# EAGLE design IO (EAGLE 4.16)

## Sheet 1 of 2
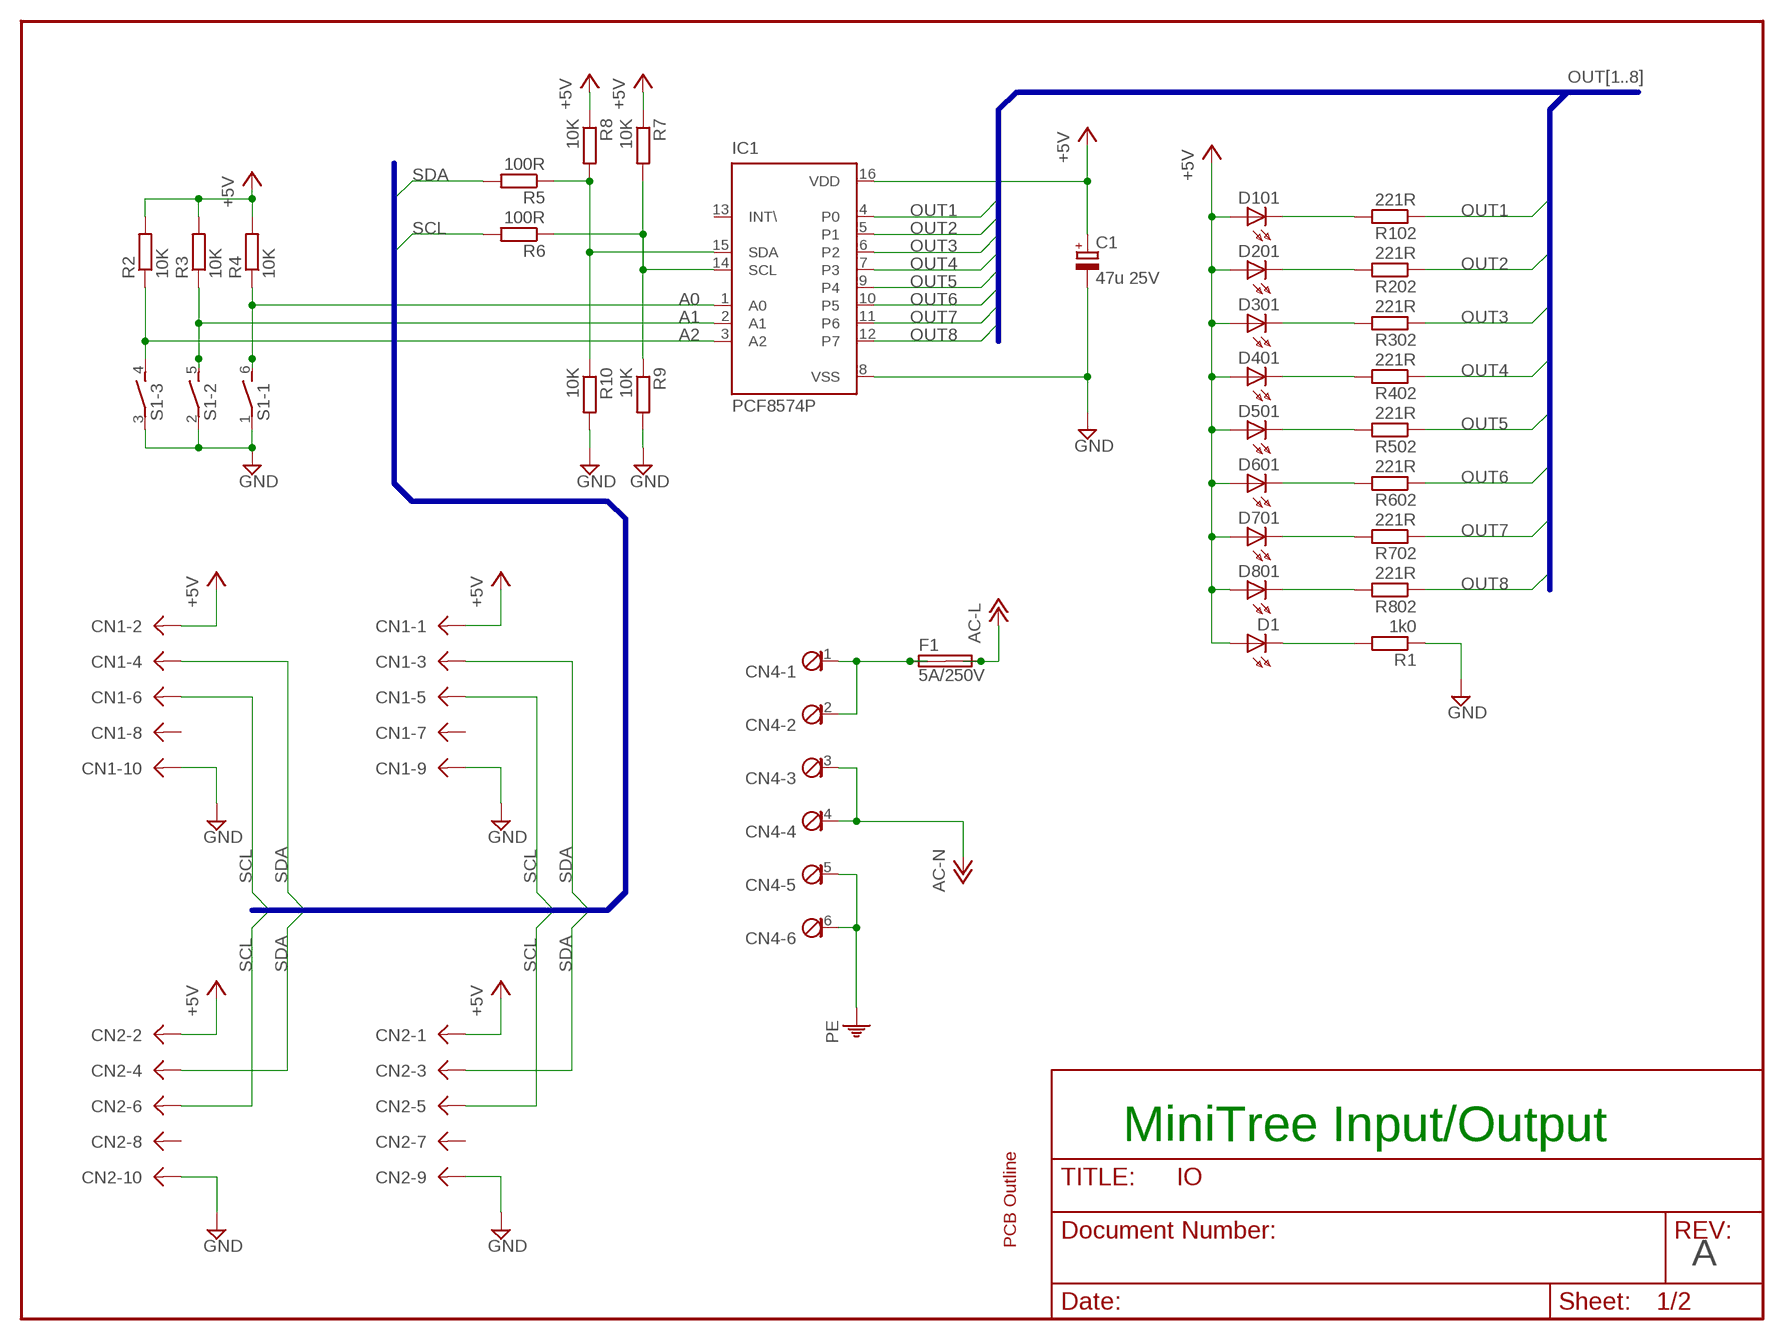
[diagram p0: schematic, sheet 1]

### Parts
C1  47u 25V  CPOL-EUD  [PANASONIC_D]
CN1  HDR2X5  [HDR2X5]
CN2  HDR2X5  [HDR2X5]
CN4  OSTTB06  [OSTTB06]
D1  LEDSMT1206  [1206]
D101  LEDSMT1206  [1206]
D201  LEDSMT1206  [1206]
D301  LEDSMT1206  [1206]
D401  LEDSMT1206  [1206]
D501  LEDSMT1206  [1206]
D601  LEDSMT1206  [1206]
D701  LEDSMT1206  [1206]
D801  LEDSMT1206  [1206]
F1  5A/250V  SHK20L  [SHK20L]
IC1  PCF8574P  [DIL16]
R1  1k0  R-EU_M1206  [M1206]
R2  10K  R-EU_M1206  [M1206]
R3  10K  R-EU_M1206  [M1206]
R4  10K  R-EU_M1206  [M1206]
R5  100R  R-EU_M1206  [M1206]
R6  100R  R-EU_M1206  [M1206]
R7  10K  R-EU_M1206  [M1206]
R8  10K  R-EU_M1206  [M1206]
R9  10K  R-EU_M1206  [M1206]
R10  10K  R-EU_M1206  [M1206]
R102  221R  R-EU_M1206  [M1206]
R202  221R  R-EU_M1206  [M1206]
R302  221R  R-EU_M1206  [M1206]
R402  221R  R-EU_M1206  [M1206]
R502  221R  R-EU_M1206  [M1206]
R602  221R  R-EU_M1206  [M1206]
R702  221R  R-EU_M1206  [M1206]
R802  221R  R-EU_M1206  [M1206]
S1  DS03E  [DS-03]
U$2  3.5X6_8TRIACS  [3.5X6_8TRIACS]

### Nets
+5V: C1.+ CN1.1 CN1.2 CN2.1 CN2.2 D1.A D101.A D201.A D301.A D401.A D501.A D601.A D701.A D801.A IC1.16(VDD) R2.2 R3.2 R4.2 R7.1 R8.1 ; also sheet 2
A0: IC1.1(A0) R4.1 S1.6
A1: IC1.2(A1) R3.1 S1.5
A2: IC1.3(A2) R2.1 S1.4
AC-L: F1.2A F1.2B ; also sheet 2
AC-N: CN4.3 CN4.4 ; also sheet 2
GND: C1.- CN1.9 CN1.10 CN2.9 CN2.10 IC1.8(VSS) R1.1 R9.2 R10.2 S1.1 S1.2 S1.3
N$33: D101.C R102.2
N$35: CN4.1 CN4.2 F1.1A F1.1B
N$36: D201.C R202.2
N$37: D301.C R302.2
N$38: D401.C R402.2
N$39: D501.C R502.2
N$40: D601.C R602.2
N$41: D701.C R702.2
N$42: D801.C R802.2
N$43: D1.C R1.2
N$46: IC1.14(SCL) R6.1 R7.2 R9.1
N$47: IC1.15(SDA) R5.1 R8.2 R10.1
OUT1: IC1.4(P0) R102.1 ; also sheet 2
OUT2: IC1.5(P1) R202.1 ; also sheet 2
OUT3: IC1.6(P2) R302.1 ; also sheet 2
OUT4: IC1.7(P3) R402.1 ; also sheet 2
OUT5: IC1.9(P4) R502.1 ; also sheet 2
OUT6: IC1.10(P5) R602.1 ; also sheet 2
OUT7: IC1.11(P6) R702.1 ; also sheet 2
OUT8: IC1.12(P7) R802.1 ; also sheet 2
PE: CN4.5 CN4.6 ; also sheet 2
SCL: CN1.5 CN1.6 CN2.5 CN2.6 R6.2
SDA: CN1.3 CN1.4 CN2.3 CN2.4 R5.2
Unconnected: CN1.7 CN1.8 CN2.7 CN2.8 IC1.13(INT\)

### Buses
OUT[1..8]
SCL,SDA

### Notes on the sheet
- MiniTree Input/Output
- A

## Sheet 2 of 2
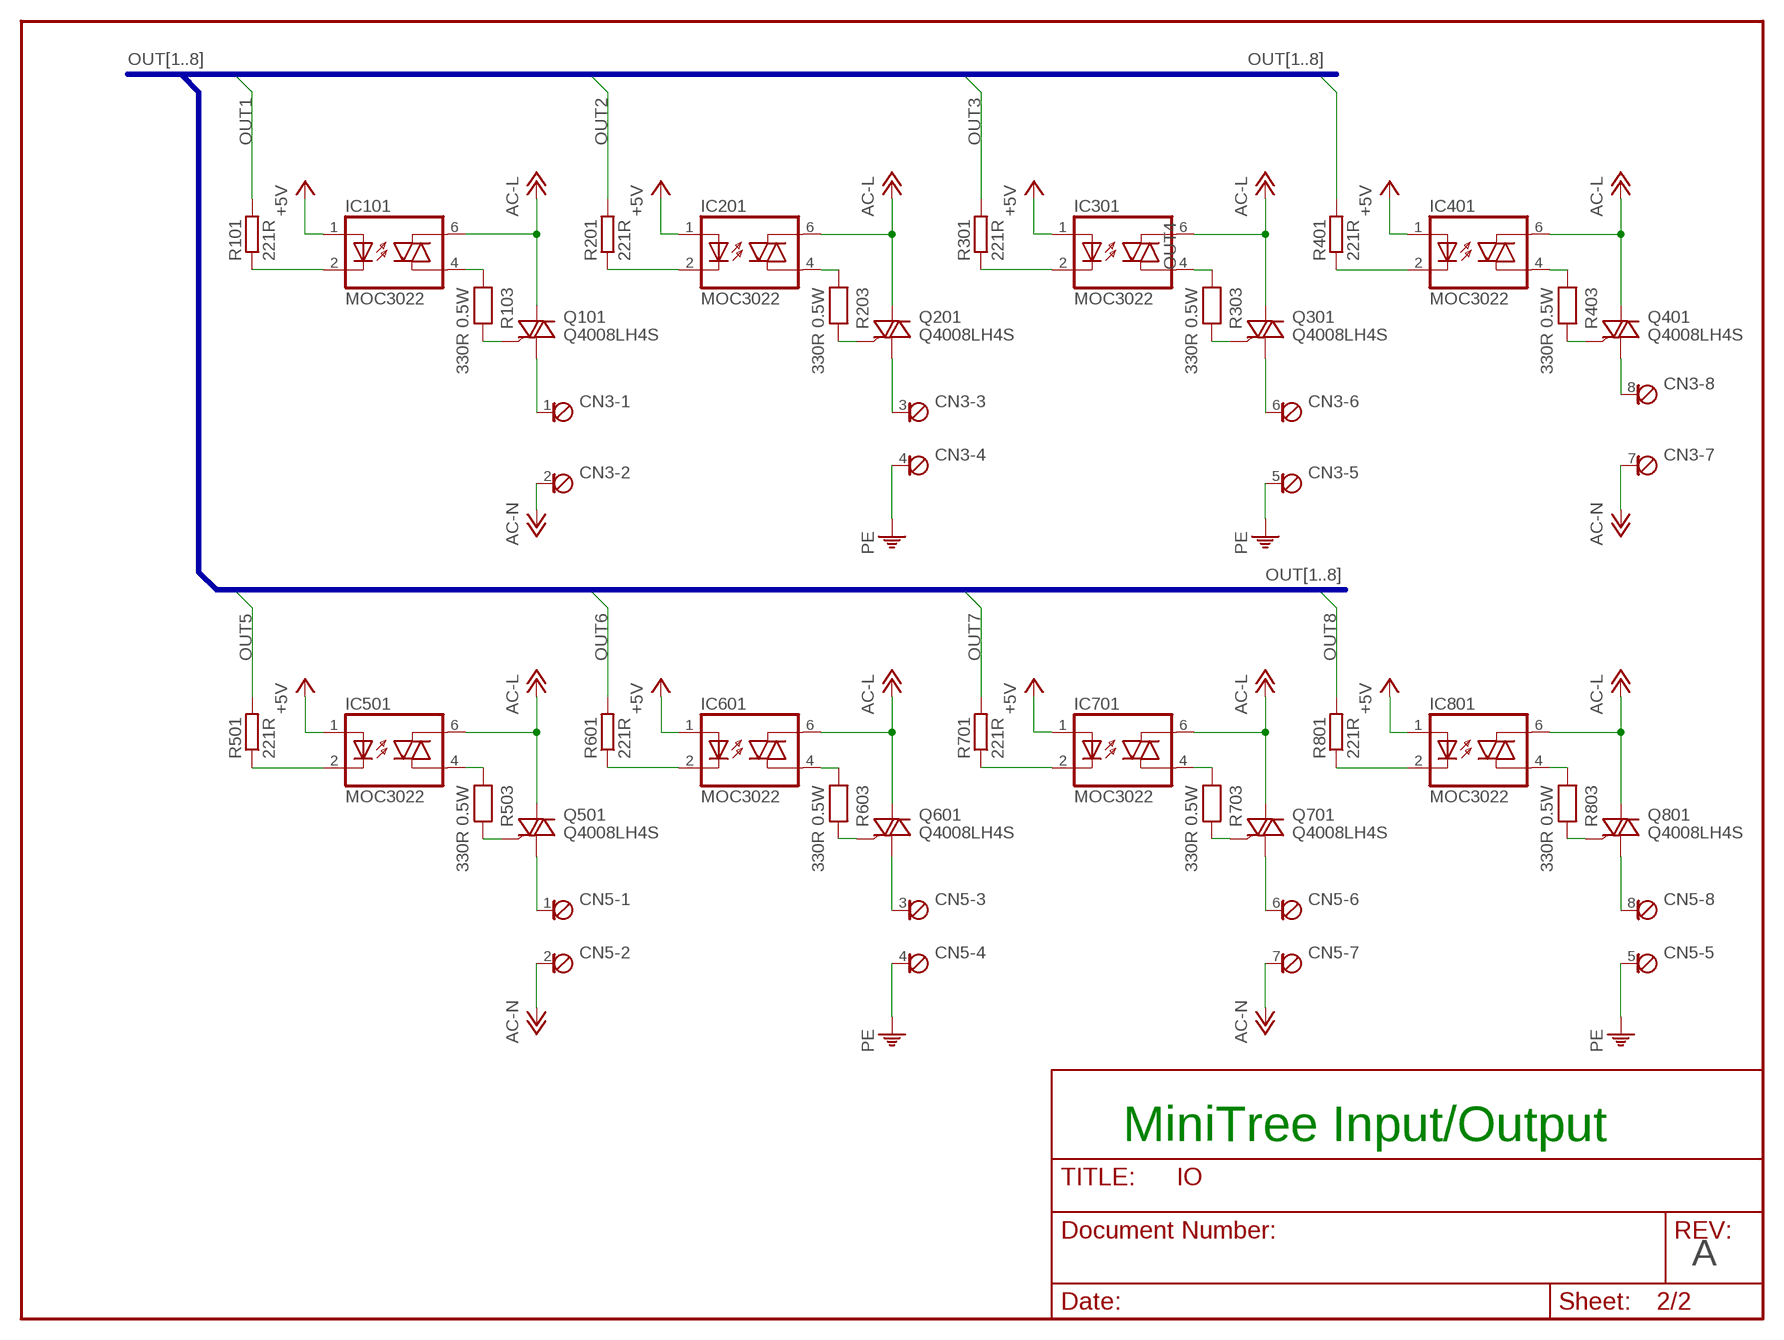
[diagram p1: schematic, sheet 2]

### Parts
CN3  OSTTB08  [OSTTB08]
CN5  OSTTB08  [OSTTB08]
IC101  MOC3022  [DIL06]
IC201  MOC3022  [DIL06]
IC301  MOC3022  [DIL06]
IC401  MOC3022  [DIL06]
IC501  MOC3022  [DIL06]
IC601  MOC3022  [DIL06]
IC701  MOC3022  [DIL06]
IC801  MOC3022  [DIL06]
Q101  Q4008LH4S  [TO220TRI2]
Q201  Q4008LH4S  [TO220TRI2]
Q301  Q4008LH4S  [TO220TRI2]
Q401  Q4008LH4S  [TO220TRI2]
Q501  Q4008LH4S  [TO220TRI2]
Q601  Q4008LH4S  [TO220TRI2]
Q701  Q4008LH4S  [TO220TRI2]
Q801  Q4008LH4S  [TO220TRI2]
R101  221R  R-EU_M1206  [M1206]
R103  330R 0.5W  RESEU-10  [R-10]
R201  221R  R-EU_M1206  [M1206]
R203  330R 0.5W  RESEU-10  [R-10]
R301  221R  R-EU_M1206  [M1206]
R303  330R 0.5W  RESEU-10  [R-10]
R401  221R  R-EU_M1206  [M1206]
R403  330R 0.5W  RESEU-10  [R-10]
R501  221R  R-EU_M1206  [M1206]
R503  330R 0.5W  RESEU-10  [R-10]
R601  221R  R-EU_M1206  [M1206]
R603  330R 0.5W  RESEU-10  [R-10]
R701  221R  R-EU_M1206  [M1206]
R703  330R 0.5W  RESEU-10  [R-10]
R801  221R  R-EU_M1206  [M1206]
R803  330R 0.5W  RESEU-10  [R-10]

### Nets
+5V: IC101.1(A) IC201.1(A) IC301.1(A) IC401.1(A) IC501.1(A) IC601.1(A) IC701.1(A) IC801.1(A) ; also sheet 1
AC-L: IC101.6(A2) IC201.6(A2) IC301.6(A2) IC401.6(A2) IC501.6(A2) IC601.6(A2) IC701.6(A2) IC801.6(A2) Q101.A2(MT2) Q201.A2(MT2) Q301.A2(MT2) Q401.A2(MT2) Q501.A2(MT2) Q601.A2(MT2) Q701.A2(MT2) Q801.A2(MT2) ; also sheet 1
AC-N: CN3.2 CN3.7 CN5.2 CN5.7 ; also sheet 1
N$1: IC101.2(C) R101.1
N$2: IC801.2(C) R801.1
N$3: CN3.1 Q101.A1(MT1)
N$4: IC201.2(C) R201.1
N$5: IC701.2(C) R701.1
N$6: IC601.2(C) R601.1
N$7: IC501.2(C) R501.1
N$8: CN3.3 Q201.A1(MT1)
N$9: IC301.2(C) R301.1
N$10: IC401.2(C) R401.1
N$11: CN3.6 Q301.A1(MT1)
N$12: CN3.8 Q401.A1(MT1)
N$13: CN5.1 Q501.A1(MT1)
N$14: CN5.3 Q601.A1(MT1)
N$15: CN5.6 Q701.A1(MT1)
N$16: CN5.8 Q801.A1(MT1)
N$18: IC101.4(A1) R103.1
N$19: Q101.G R103.2
N$20: IC401.4(A1) R403.1
N$21: Q401.G R403.2
N$22: Q301.G R303.2
N$23: IC301.4(A1) R303.1
N$24: IC201.4(A1) R203.1
N$25: Q201.G R203.2
N$26: Q801.G R803.2
N$27: Q701.G R703.2
N$28: Q601.G R603.2
N$29: IC801.4(A1) R803.1
N$30: IC701.4(A1) R703.1
N$31: IC601.4(A1) R603.1
N$32: IC501.4(A1) R503.1
N$34: Q501.G R503.2
OUT1: R101.2 ; also sheet 1
OUT2: R201.2 ; also sheet 1
OUT3: R301.2 ; also sheet 1
OUT4: R401.2 ; also sheet 1
OUT5: R501.2 ; also sheet 1
OUT6: R601.2 ; also sheet 1
OUT7: R701.2 ; also sheet 1
OUT8: R801.2 ; also sheet 1
PE: CN3.4 CN3.5 CN5.4 CN5.5 ; also sheet 1

### Buses
OUT[1..8]

### Notes on the sheet
- MiniTree Input/Output
- A

## Library data of the parts
C1 = rcl:CPOL-EU: POLARIZED CAPACITOR, European symbol
CN1 CN2 = con-amp-modu-header:HDR2X5
CN3 CN5 = con-OSTTBXX:OSTTB08
CN4 = con-OSTTBXX:OSTTB06
D1 D101 D201 D301 D401 D501 D601 D701 D801 = led:LED: LED
F1 = fuse:SHK20L: FUSE HOLDER 5 x 20 mm, SH contact, SHH1 Schukat, E1073 Buerklin
IC1 = micro-philips:PCF8574: I2C-Bus I/O DEVICE
IC101 IC201 IC301 IC401 IC501 IC601 IC701 IC801 = optocoupler:MOC3022
Q101 Q201 Q301 Q401 Q501 Q601 Q701 Q801 = triac:Q4008LH4
R1-R10 R101 R102 R201 R202 R301 R302 R401 R402 R501 R502 R601 R602 R701 R702 R801 R802 = rcl:R-EU_: RESISTOR, European symbol
R103 R203 R303 R403 R503 R603 R703 R803 = discrete:RESEU-10
S1 = switch-dil:DS03E: DIL/CODE SWITCH
U$2 = PCB_Outlines:3.5X6_8TRIACS

## Board
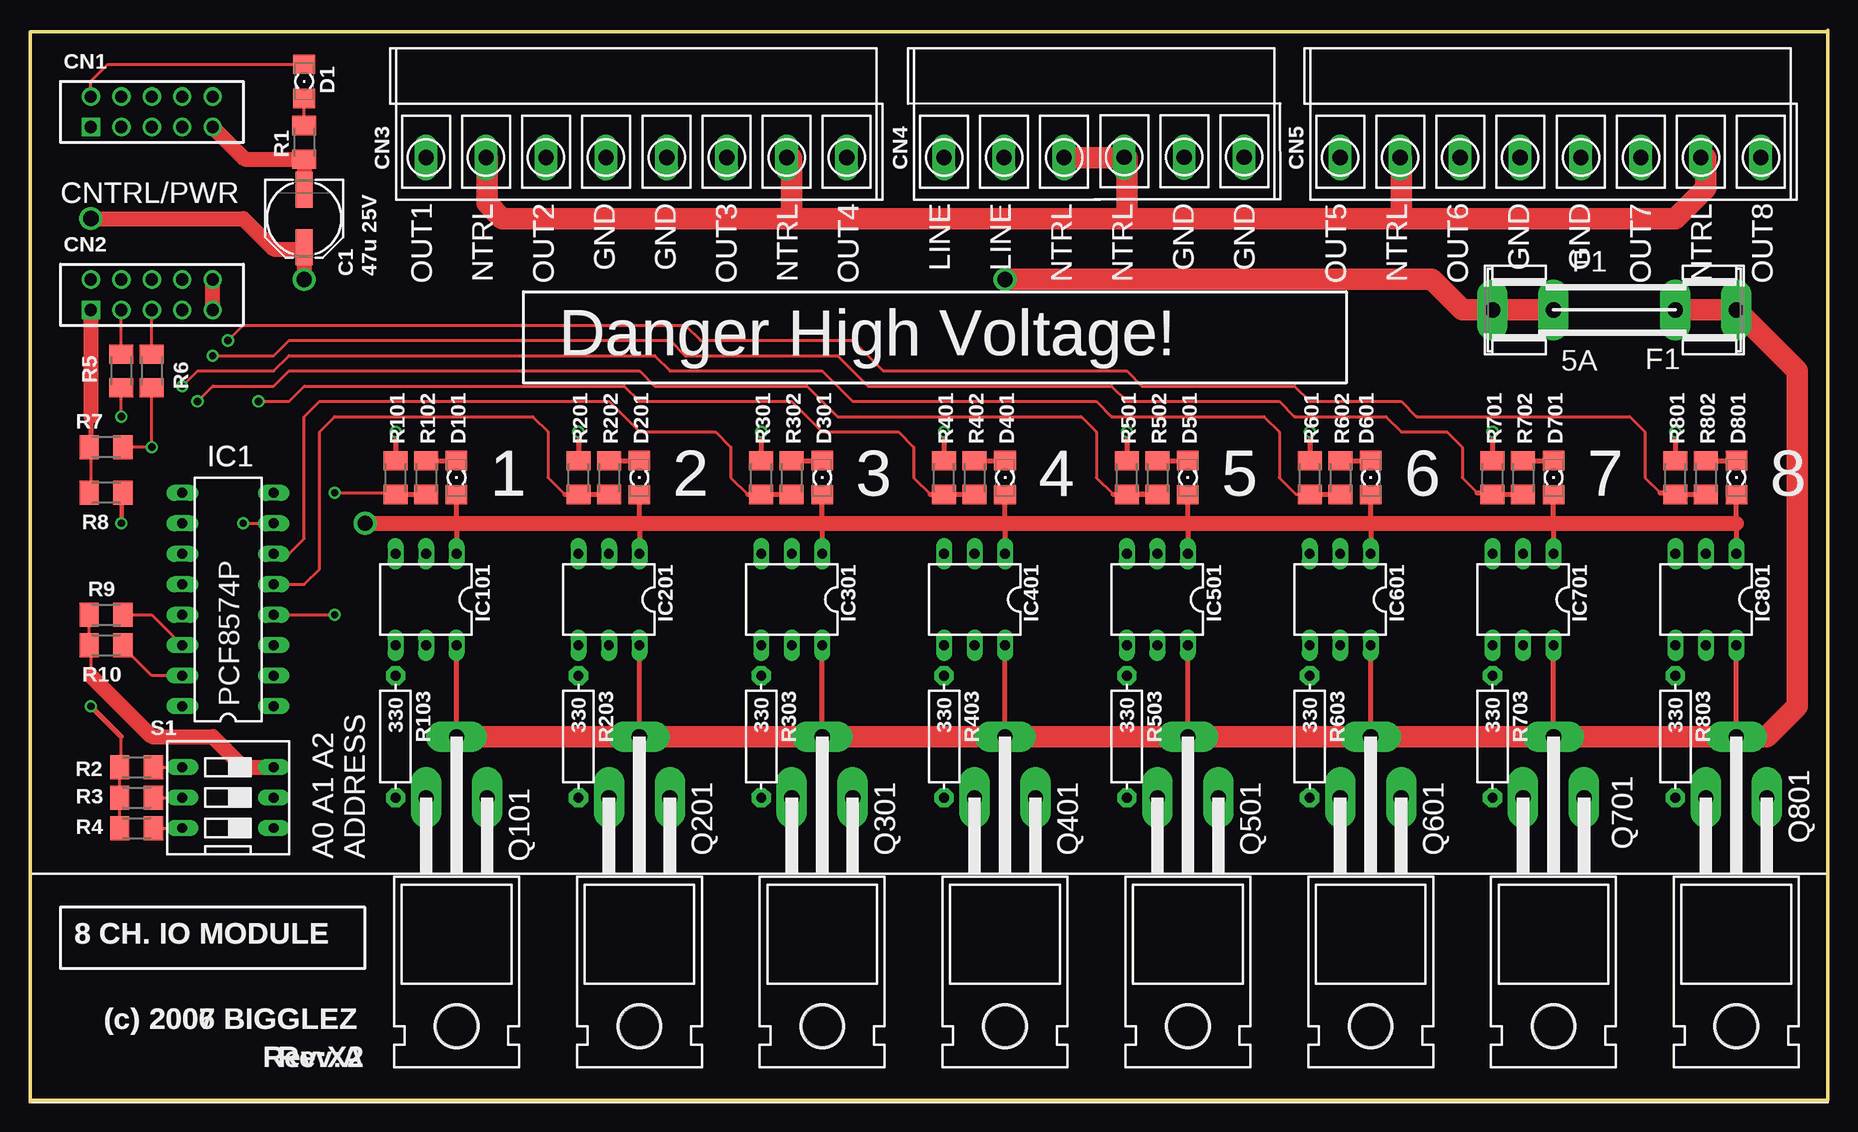
[diagram p2: board, top side]
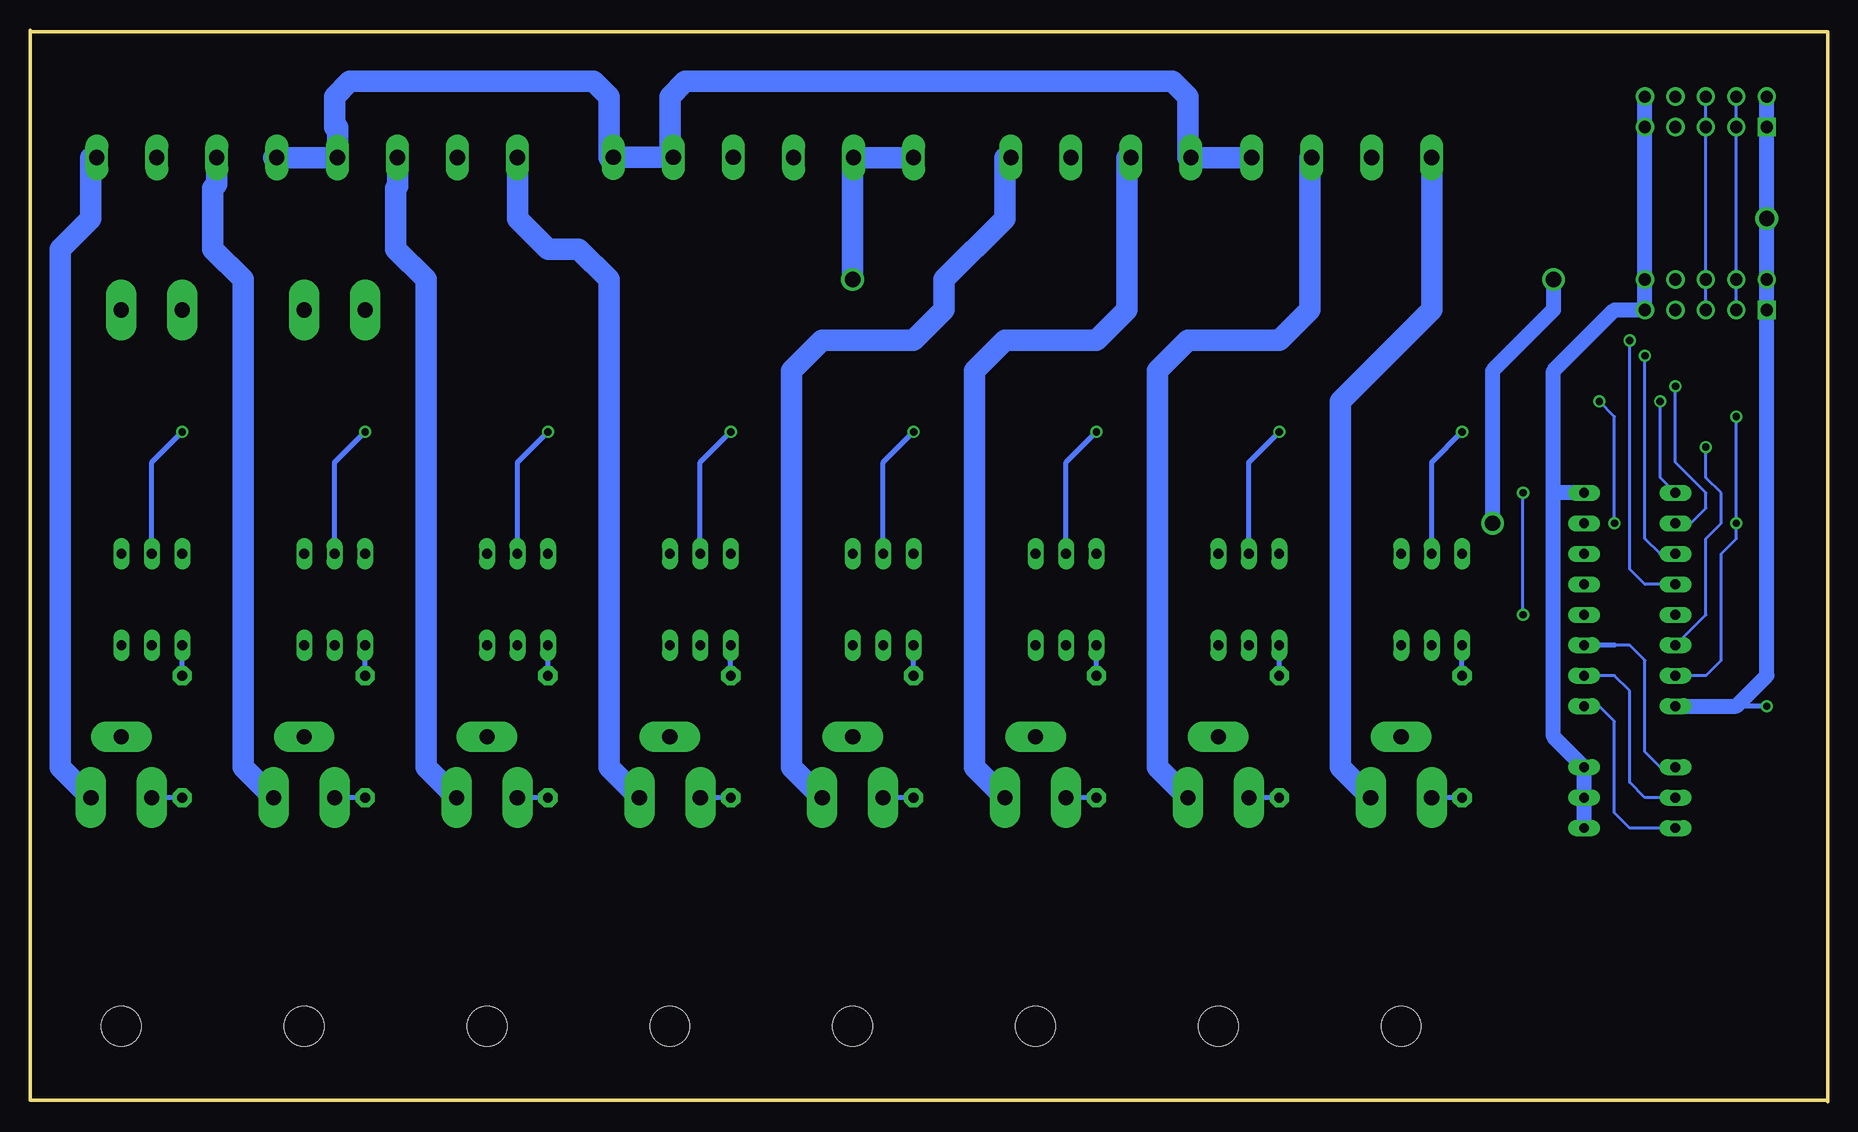
[diagram p3: board, bottom side, seen from below]

Size 149.85 x 89.33 mm. Coordinates in mm from the lower left corner, seen from the top.
Copper layers (1*16): Top 0.035mm / dielectric 1.5mm / Bottom 0.035mm
Design rules "default": minimum track width 10mil, minimum drill 24mil, track to track 8mil, track to pad 8mil, pad to pad 8mil, via to via 8mil, smd to smd 8mil, copper to edge 40mil, drill to drill 8mil, minimum pad ring 10mil, minimum via ring 8mil, stop-mask expansion 4mil, vias tented up to drill 0mil, thermal gap 10mil

### Footprints (pad centres in the part's own frame; a part is rotated, then mirrored left to right if it is on the bottom)
PANASONIC_D = smd 3 x 1.4: + 2.4,0; - -2.4,0
HDR2X5 = drill 1.016 square: 1 0,0 | drill 1.016 round: 2 0,2.54; 3 2.54,0; 4 2.54,2.54; 5 5.08,0; 6 5.08,2.54; 7 7.62,0; 8 7.62,2.54; 9 10.16,0; 10 10.16,2.54
OSTTB08 = drill 1.27 long: 1 0,0; 2 5,0; 3 10,0; 4 15,0; 5 20.066,0; 6 25.066,0; 7 30.066,0; 8 35.066,0
OSTTB06 = drill 1.27 long: 1 0,0; 2 5,0; 3 10,0; 4 15.02,0.03; 5 20.02,0.03; 6 25.02,0.03
1206 = smd 1.6 x 1.803: A -1.422,0; C 1.422,0
SHK20L = drill 1.27 pad 2.54 long: 1A -10.16,0; 1B -5.08,0; 2A 10.16,0; 2B 5.08,0
DIL16 = drill 0.813 long: 1 -8.89,-3.81; 2 -6.35,-3.81; 3 -3.81,-3.81; 4 -1.27,-3.81; 5 1.27,-3.81; 6 3.81,-3.81; 7 6.35,-3.81; 8 8.89,-3.81; 9 8.89,3.81; 10 6.35,3.81; 11 3.81,3.81; 12 1.27,3.81; 13 -1.27,3.81; 14 -3.81,3.81; 15 -6.35,3.81; 16 -8.89,3.81
DIL06 = drill 0.813 long: 1 -2.54,-3.81; 2 0,-3.81; 3 2.54,-3.81; 4 2.54,3.81; 5 0,3.81; 6 -2.54,3.81
TO220TRI2 = drill 1.27 pad 2.54 long: A1 -2.54,-7.62; A2 0,-12.7; G 2.54,-7.62
M1206 = smd 1.6 x 2: 1 -1.4,0; 2 1.4,0
R-10 = drill 0.813 pad 1.6 octagon: 1 -5.08,0; 2 5.08,0
DS-03 = drill 0.813 long: 1 -2.54,-3.81; 2 0,-3.81; 3 2.54,-3.81; 4 2.54,3.81; 5 0,3.81; 6 -2.54,3.81
3.5X6_8TRIACS = hole 3.302: 142.24,6.35; 127,6.35; 111.76,6.35; 96.52,6.35; 81.28,6.35; 66.04,6.35; 50.8,6.35; 35.56,6.35

### Placement (x,y rotation side)
C1  22.86,73.62 270 top
CN1  5.08,81.24 0 top
CN2  5.08,66 0 top
CN3  33.02,78.7 0 top
CN4  76.2,78.7 0 top
CN5  109.22,78.7 0 top
D1  22.86,85.05 270 top
D101  35.55,52.03 90 top
D201  50.79,52.03 90 top
D301  66.04,52.03 90 top
D401  81.28,52.03 90 top
D501  96.52,52.03 90 top
D601  111.76,52.03 90 top
D701  127,52.03 90 top
D801  142.24,52.03 90 top
F1  132.08,66 0 top
IC1  16.51,41.87 90 top
IC101  33.02,41.87 180 top
IC201  48.25,41.87 180 top
IC301  63.49,41.87 180 top
IC401  78.73,41.87 180 top
IC501  93.98,41.87 180 top
IC601  109.22,41.87 180 top
IC701  124.45,41.87 180 top
IC801  139.69,41.87 180 top
Q101  35.55,17.74 180 top
Q201  50.79,17.74 180 top
Q301  66.04,17.74 180 top
Q401  81.28,17.74 180 top
Q501  96.52,17.74 180 top
Q601  111.76,17.74 180 top
Q701  127,17.74 180 top
Q801  142.24,17.74 180 top
R1  22.86,79.97 90 top
R2  8.88,27.9 180 top
R3  8.88,25.36 180 top
R4  8.88,22.82 180 top
R5  7.62,60.92 90 top
R6  10.15,60.92 90 top
R7  6.34,54.57 0 top
R8  6.34,50.76 0 top
R9  6.34,40.6 180 top
R10  6.34,38.06 180 top
R101  30.48,52.03 270 top
R102  33.02,52.03 90 top
R103  30.48,30.44 270 top
R201  45.71,52.03 270 top
R202  48.25,52.03 90 top
R203  45.71,30.44 270 top
R301  60.95,52.03 270 top
R302  63.49,52.03 90 top
R303  60.95,30.44 270 top
R401  76.2,52.03 270 top
R402  78.73,52.03 90 top
R403  76.2,30.44 270 top
R501  91.44,52.03 270 top
R502  93.98,52.03 90 top
R503  91.44,30.44 270 top
R601  106.68,52.03 270 top
R602  109.22,52.03 90 top
R603  106.68,30.44 270 top
R701  121.92,52.03 270 top
R702  124.45,52.03 90 top
R703  121.92,30.44 270 top
R801  137.16,52.03 270 top
R802  139.69,52.03 90 top
R803  137.16,30.44 270 top
S1  16.51,25.36 90 top
U$2  -0.01,-0.04 0 top

### Tracks (layer width: path | path; a pad name or v marks a point on that pad's centre or on a via)
+5V  (via drill 0.61, 1.27)
  Top 0.254: D1.A 6.5,86.47 5.08,85.05 CN1.2 | R4.2 7.49,25.23 7.62,25.36 R3.2 7.49,27.77 7.62,27.9 | 7.62,27.9 R2.2 | 7.62,27.9 7.62,30.44 | R8.1 5.08,50.76 5.08,54.57 R7.1
  Top 0.406: IC701.1 127,48.22 D701.A 127,50.76 | IC601.1 111.76,48.22 D601.A 111.76,50.76 | IC501.1 96.52,48.22 D501.A 96.52,50.76 | IC401.1 81.28,48.22 D401.A 81.28,50.76 | IC301.1 66.04,48.22 D301.A 66.04,50.76 | IC201.1 50.79,48.22 D201.A 50.79,50.76 | D801.A 142.24,48.22 IC801.1 | 35.55,50.76 D101.A 35.55,48.22 IC101.1 | 5.08,57.11 5.08,54.57 | 7.62,30.44 v5.08,32.98
  Top 1.27: 142.24,48.22 127,48.22 111.76,48.22 96.52,48.22 81.28,48.22 66.04,48.22 50.79,48.22 35.55,48.22 v27.94,48.22 | 22.86,71.08 v22.86,68.54 | CN2.1 5.08,57.11 | v5.08,73.62 17.78,73.62 20.32,71.08 22.86,71.08 | 22.86,71.08 C1.+
  Bottom 0.406: v5.08,32.98 IC1.16
  Bottom 1.27: CN2.2 v5.08,73.62 | v5.08,73.62 CN1.1 | CN2.2 CN2.1 5.08,35.52 7.62,32.98 IC1.16 | v27.94,48.22 27.94,60.92 22.86,66 v22.86,68.54 | CN2.2 v5.08,73.62 | CN1.1 CN1.2 CN1.1
A0
  Top 0.254: R4.1 S1.6
  Bottom 0.254: IC1.1 19.05,32.98 17.78,31.71 17.78,24.09 16.51,22.82 S1.6
A1
  Top 0.254: R3.1 S1.5
  Bottom 0.254: IC1.2 17.78,35.52 16.51,34.25 16.51,26.63 15.23,25.36 S1.5
A2
  Top 0.254: R2.1 S1.4
  Bottom 0.254: 17.78,38.06 16.51,38.06 15.23,36.79 15.23,29.17 13.96,27.9 S1.4
  Bottom 0.406: 17.78,38.06 IC1.3
AC-L
  Top 0.406: Q601.A2 111.76,30.19 | Q601.A2 IC601.6 Q601.A2 | Q701.A2 IC701.6 | Q401.A2 IC401.6 | Q301.A2 IC301.6 | Q201.A2 IC201.6 | Q301.A2 IC301.6 | Q301.A2 IC301.6 | Q801.A2 IC801.6 Q801.A2 | Q501.A2 IC501.6 Q501.A2 | Q101.A2 IC101.6 Q101.A2
  Top 1.778: Q101.A2 Q201.A2 Q301.A2 Q401.A2 Q501.A2 Q601.A2 Q701.A2 Q801.A2 144.78,30.44 147.31,32.98 147.31,60.92 F1.2A F1.2B
AC-N
  Top 0.406: 114.3,78.7 CN5.2
  Top 1.778: 114.3,73.62 137.16,73.62 139.69,76.16 139.69,78.7 CN5.7 | 114.3,73.62 114.3,78.7 | 91.44,78.7 91.41,78.73 CN4.4 | 91.44,78.7 CN4.3 | 91.44,73.62 91.44,78.7 | 91.44,73.62 114.3,73.62 | CN3.7 63.49,78.7 63.49,73.62 | 63.49,73.62 91.44,73.62 | 63.49,73.62 39.36,73.62 38.09,74.89 38.09,78.7 CN3.2
GND
  Top 0.254: R10.2 4.95,37.93 5.08,38.06 | R10.2 5.08,38.06 | 5.08,38.06 5.08,35.52 | R9.2 5.08,40.6 4.95,40.47 R10.2
  Top 1.27: R1.1 17.91,78.57 CN1.9 | CN2.9 CN2.10 | 5.08,35.52 10.15,30.44 15.23,30.44 17.78,27.9 S1.3 | R1.1 22.86,78.7 | R1.1 C1.-
  Bottom 1.27: CN1.10 CN1.9 CN2.10 CN2.9 17.78,66 22.86,60.92 22.86,50.76 | S1.1 S1.2 S1.3 22.86,30.44 22.86,50.76 | IC1.8 22.86,50.76
N$1  (via drill 0.61)
  Top 0.406: 30.48,53.3 R101.1 v30.48,55.84
  Bottom 0.406: IC101.2 33.02,53.3 v30.48,55.84
N$2  (via drill 0.61)
  Top 0.406: 137.16,53.3 R801.1 v137.16,55.84
  Bottom 0.406: IC801.2 139.69,53.3 v137.16,55.84
N$3
  Bottom 1.778: Q101.A1 40.63,27.9 40.63,58.38 33.02,66 CN3.1
N$4  (via drill 0.61)
  Top 0.406: 45.71,53.3 R201.1 v45.71,55.84
  Bottom 0.406: IC201.2 48.25,53.3 v45.71,55.84
N$5  (via drill 0.61)
  Top 0.406: 121.92,53.3 R701.1 v121.92,55.84
  Bottom 0.406: IC701.2 124.45,53.3 v121.92,55.84
N$6  (via drill 0.61)
  Top 0.406: 106.68,53.3 R601.1 v106.68,55.84
  Bottom 0.406: IC601.2 109.22,53.3 v106.68,55.84
N$7  (via drill 0.61)
  Top 0.406: 91.44,53.3 R501.1 v91.44,55.84
  Bottom 0.406: IC501.2 93.98,53.3 v91.44,55.84
N$8
  Bottom 1.778: Q201.A1 55.88,27.9 55.88,60.92 53.34,63.46 45.71,63.46 43.17,66 43.17,78.7 CN3.3
N$9  (via drill 0.61)
  Top 0.406: v60.95,55.84 R301.1
  Bottom 0.406: IC301.2 63.49,53.3 v60.95,55.84
N$10  (via drill 0.61)
  Top 0.406: v76.2,55.84 R401.1
  Bottom 0.406: IC401.2 78.73,53.3 v76.2,55.84
N$11
  Bottom 1.778: Q301.A1 71.12,27.9 71.12,60.92 68.58,63.46 60.95,63.46 58.41,66 58.41,78.7 CN3.6
N$12
  Bottom 1.778: Q401.A1 86.36,27.9 86.36,60.92 83.81,63.46 76.2,63.46 73.66,66 73.66,68.54 68.58,73.62 68.58,78.7 CN3.8
N$13
  Bottom 1.778: CN5.1 109.22,73.62 106.68,71.08 104.14,71.08 101.59,68.54 101.59,27.9 Q501.A1
N$14
  Bottom 1.778: CN5.3 119.22,76.32 119.38,76.16 119.38,71.08 116.84,68.54 116.84,27.9 Q601.A1
N$15
  Bottom 1.778: CN5.6 134.28,76.5 134.62,76.16 134.62,71.08 132.08,68.54 132.08,27.9 Q701.A1
N$16
  Bottom 1.778: CN5.8 144.78,78.7 144.78,73.62 147.31,71.08 147.31,27.9 Q801.A1
N$18
  Bottom 0.406: R103.1 IC101.4
N$19
  Bottom 0.406: R103.2 Q101.G
N$20
  Bottom 0.406: R403.1 IC401.4
N$21
  Bottom 0.406: R403.2 Q401.G
N$22
  Bottom 0.406: R303.2 Q301.G
N$23
  Bottom 0.406: R303.1 IC301.4
N$24
  Bottom 0.406: R203.1 IC201.4
N$25
  Bottom 0.406: R203.2 Q201.G
N$26
  Bottom 0.406: R803.2 Q801.G
N$27
  Bottom 0.406: R703.2 Q701.G
N$28
  Bottom 0.406: R603.2 Q601.G
N$29
  Bottom 0.406: R803.1 IC801.4
N$30
  Bottom 0.406: R703.1 IC701.4
N$31
  Bottom 0.406: R603.1 IC601.4
N$32
  Bottom 0.406: 91.44,37.81 R503.1 IC501.4
N$33
  Top 0.406: R102.2 33.02,53.3 33.17,53.45 D101.C
N$34
  Bottom 0.406: R503.2 Q501.G
N$35  (via drill 1.27)
  Top 1.778: v81.28,68.54 116.84,68.54 119.38,66 F1.1A F1.1B
  Bottom 1.778: v81.28,68.54 81.28,78.7 CN4.2 CN4.1
N$36
  Top 0.406: R202.2 48.25,53.3 48.41,53.45 D201.C
N$37
  Top 0.406: R302.2 63.49,53.3 63.65,53.45 D301.C
N$38
  Top 0.406: R402.2 78.73,53.3 78.89,53.45 D401.C
N$39
  Top 0.406: R502.2 93.98,53.3 94.13,53.45 D501.C
N$40
  Top 0.406: R602.2 109.22,53.3 109.37,53.45 D601.C
N$41
  Top 0.406: R702.2 124.45,53.3 124.61,53.45 D701.C
N$42
  Top 0.406: R802.2 139.69,53.3 139.85,53.45 D801.C
N$43
  Top 0.254: 22.86,81.24 R1.2 D1.C
N$46  (via drill 0.61)
  Top 0.254: 7.75,40.47 R9.1 10.15,40.6 IC1.14 | 10.15,59.65 R6.1 v10.15,54.57 R7.2
  Bottom 0.254: IC1.14 10.15,40.6 10.15,46.95 8.88,48.22 8.88,50.76 10.15,52.03 v10.15,54.57
N$47  (via drill 0.61)
  Top 0.254: IC1.15 10.15,35.52 7.62,38.06 R10.1 | v7.62,57.11 R5.1 | 7.62,50.76 R8.2 7.75,48.35 v7.62,48.22 7.62,50.76
  Bottom 0.254: v7.62,57.11 v7.62,48.22 7.62,46.95 8.88,45.68 8.88,36.79 10.15,35.52 IC1.15
OUT1  (via drill 0.61)
  Top 0.254: IC1.4 v25.39,40.6 | v25.39,50.76 30.48,50.76
  Top 0.406: R101.2 30.48,50.76 30.61,50.63 R102.1
  Bottom 0.254: v25.39,40.6 v25.39,50.76
OUT2
  Top 0.254: 44.57,50.63 43.17,52.03 43.17,55.84 41.9,57.11 25.39,57.11 24.12,55.84 24.12,44.41 22.86,43.14 IC1.5
  Top 0.406: R202.1 45.84,50.63 45.71,50.76 R201.2 44.57,50.63
OUT3
  Top 0.254: 59.81,50.63 58.41,52.03 58.41,54.57 57.14,55.84 50.79,55.84 48.25,58.38 24.12,58.38 22.86,57.11 22.86,46.95 21.59,45.68 IC1.6
  Top 0.406: R302.1 61.09,50.63 60.95,50.76 R301.2 59.81,50.63
OUT4  (via drill 0.61)
  Top 0.254: 75.06,50.63 73.66,52.03 73.66,54.57 72.39,55.84 66.04,55.84 63.49,58.38 50.79,58.38 49.52,59.65 22.86,59.65 21.59,58.38 v19.05,58.38 | v17.78,48.22 IC1.7
  Top 0.406: R402.1 76.33,50.63 76.2,50.76 R401.2 75.06,50.63
  Bottom 0.254: v17.78,48.22 17.78,57.11 v19.05,58.38
OUT5  (via drill 0.61)
  Top 0.254: 90.3,50.63 88.9,52.03 88.9,55.84 87.62,57.11 67.31,57.11 64.77,59.65 52.06,59.65 50.79,60.92 21.59,60.92 20.32,59.65 15.23,59.65 v13.96,58.38
  Top 0.406: R501.2 91.44,50.76 91.56,50.63 R502.1 90.3,50.63
  Bottom 0.254: IC1.9 13.96,52.03 v13.96,58.38
OUT6  (via drill 0.61)
  Top 0.254: R601.2 105.54,50.63 104.14,52.03 104.14,55.84 102.87,57.11 90.17,57.11 88.9,58.38 68.58,58.38 66.04,60.92 53.34,60.92 52.06,62.19 21.59,62.19 20.32,60.92 13.96,60.92 v12.69,59.65
  Top 0.406: R601.2 106.68,50.76 106.81,50.63 R602.1
  Bottom 0.254: v12.69,59.65 12.69,53.3 10.15,50.76 10.15,49.49 11.42,48.22 IC1.10
OUT7  (via drill 0.61)
  Top 0.254: 120.65,50.76 119.38,52.03 119.38,54.57 118.11,55.84 114.3,55.84 113.03,57.11 105.41,57.11 104.14,58.38 91.44,58.38 90.17,59.65 69.84,59.65 67.31,62.19 54.6,62.19 53.34,63.46 21.59,63.46 20.32,62.19 v15.23,62.19
  Top 0.406: 121.92,50.76 R701.2 | R702.1 122.05,50.63 121.92,50.76 | 120.65,50.76 121.92,50.76
  Bottom 0.254: v15.23,62.19 15.23,46.95 13.96,45.68 IC1.11
OUT8  (via drill 0.61)
  Top 0.254: 135.88,50.76 134.62,52.03 134.62,55.84 133.34,57.11 115.56,57.11 114.3,58.38 106.68,58.38 105.41,59.65 92.7,59.65 91.44,60.92 71.12,60.92 68.58,63.46 55.88,63.46 54.6,64.73 17.78,64.73 v16.51,63.46
  Top 0.406: 137.16,50.76 R801.2 | R802.1 137.28,50.63 137.16,50.76 | 135.88,50.76 137.16,50.76
  Bottom 0.254: IC1.12 15.23,43.14 16.51,44.41 v16.51,63.46
PE
  Bottom 1.778: 129.53,78.7 CN5.5 CN5.4 124.22,81.24 124.45,81.24 124.45,83.78 123.19,85.05 102.87,85.05 101.59,83.78 101.59,78.7 101.56,78.73 CN4.6 96.55,78.73 96.52,78.7 | CN3.4 CN3.5 53.34,78.7 53.34,83.78 54.6,85.05 95.25,85.05 96.52,83.78 96.52,78.7 | 96.52,78.7 96.48,78.73 CN4.5
SCL
  Top 0.254: CN2.5 R6.2 10.15,62.19
  Bottom 0.254: CN1.6 CN1.5 CN2.6 CN2.5
SDA
  Top 0.254: CN2.3 R5.2 7.62,62.19
  Bottom 0.254: CN1.4 CN1.3 CN2.4 CN2.3

### Text on the board
tPlace: CNTRL/PWR | OUT3 | NTRL | OUT4 | LINE | LINE | NTRL | NTRL | GND | GND | OUT5 | NTRL | OUT6 | GND | GND | OUT7 | NTRL | OUT8 | Danger High Voltage! | 1 | 2 | 3 | 4 | 5 | 6 | 7 | 8 | A0 A1 A2 | ADDRESS | 8 CH. IO MODULE | (c) 2006 BIGGLEZ | Rev:X2
tNames: OUT1 | NTRL | OUT2 | GND | GND
_tsilk: CN1 | D1 | R1 | CN3 | CN4 | CN5 | CNTRL/PWR | OUT1 | NTRL | OUT2 | GND | GND | OUT3 | NTRL | OUT4 | LINE | LINE | NTRL | NTRL | GND | GND | OUT5 | NTRL | OUT6 | GND | GND | OUT7 | NTRL | OUT8 | CN2 | C1 | 47u 25V | R5 | R6 | Danger High Voltage! | 5A | F1 | R7 | R101 | R102 | D101 | R201 | R202 | D201 | R301 | R302 | D301 | R401 | R402 | D401 | R501 | R502 | D501 | R601 | R602 | D601 | R701 | R702 | D701 | R801 | R802 | D801 | IC1 | 1 | 2 | 3 | 4 | 5 | 6 | 7 | 8 | R8 | IC101 | IC201 | IC301 | IC401 | IC501 | IC601 | IC701 | IC801 | R9 | R10 | 330 | R103 | 330 | R203 | 330 | R303 | 330 | R403 | 330 | R503 | 330 | R603 | 330 | R703 | 330 | R803 | PCF8574P | S1 | R2 | Q801 | Q201 | Q301 | Q401 | Q501 | Q601 | Q701 | R3 | Q101 | R4 | A0 A1 A2 | ADDRESS | 8 CH. IO MODULE | (c) 2007 BIGGLEZ | Rev:A